# Altium schematic sheet USB-TO-UART-BRIDGE.SchDoc
size A3; ApprovedBy: SI; CheckedBy: SI; Author: SI; CompanyName: KundenName; DrawnBy: SI; Engineer: SI; Organization: Sven Ingelfinger IT-Trainer; Address1: Ruländerstraße 5; Address2: 74235; Address3: Erlenbach; SheetNumber: 4; SheetTotal: 7; OrganizationDescription: Altium Trainer & Consultant
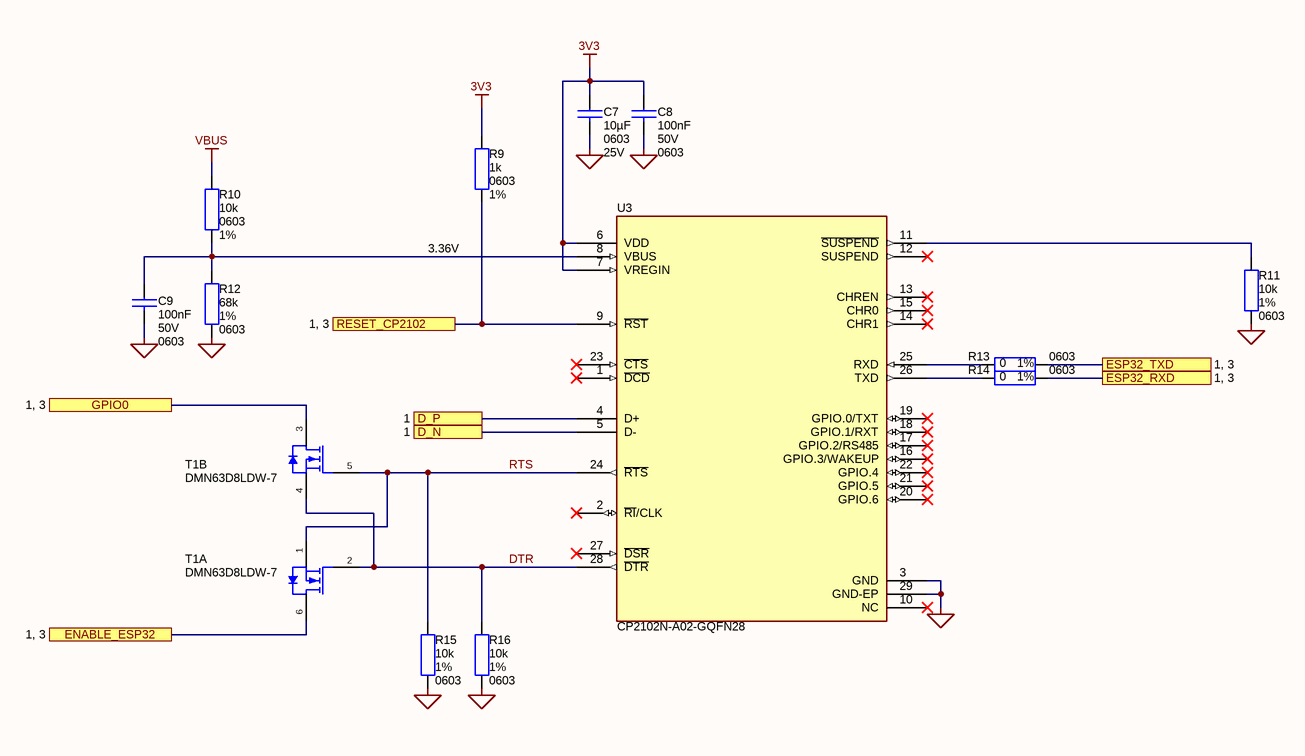
[diagram p0: USB-TO-UART-BRIDGE.SchDoc]

## Parts
C7  value 10µF  Case/Package: 0603  Voltage: 25V  [CAPC0603X37L]  (hidden comment: GRM188R61E106KA73D)
C8  value 100nF  Voltage: 50V  Case/Package: 0603  [CAPC0603X37L]  (hidden comment: C0603C104K5RACTU)
C9  value 100nF  Voltage: 50V  Case/Package: 0603  [CAPC0603X37L]  (hidden comment: C0603C104K5RACTU)
R9  value 1k  Case/Package: 0603  Tolerance: 1%  [RESC0603X21L]  (hidden comment: RC0603FR-071KL)
R10  value 10k  Case/Package: 0603  Tolerance: 1%  [RESC0603X21L]  (hidden comment: RC0603FR-0733KL)
R11  value 10k  Tolerance: 1%  Case/Package: 0603  [RESC0603X21L]  (hidden comment: RC0603FR-0710KL)
R12  value 68k  Tolerance: 1%  Case/Package: 0603  [RESC0603X21L]  (hidden comment: RC0603FR-0768KL)
R13  value 0  Case/Package: 0603  Tolerance: 1%  [RESC0603X21L]  (hidden comment: RC0603FR-070RL)
R14  value 0  Case/Package: 0603  Tolerance: 1%  [RESC0603X21L]  (hidden comment: RC0603FR-070RL)
R15  value 10k  Tolerance: 1%  Case/Package: 0603  [RESC0603X21L]  (hidden comment: RC0603FR-0710KL)
R16  value 10k  Tolerance: 1%  Case/Package: 0603  [RESC0603X21L]  (hidden comment: RC0603FR-0710KL)
T1  DMN63D8LDW-7  [SOT23-6P65_210X110L32X20]  (parts A,B of 2)
U3  CP2102N-A02-GQFN28  [CP2102N-A02-GQFN28-Footprint-1]

## Ports
D_N (see 1), D_P (see 1), ENABLE_ESP32 (see 1, 3), ESP32_RXD (see 1, 3), ESP32_TXD (see 1, 3), GPIO0 (see 1, 3), RESET_CP2102 (see 1, 3)

## Nets
3V3: C7.1 C8.1 R9.1 U3.6(VDD) U3.7(VREGIN)
GND: C7.2 C8.2 C9.2 R11.1 R12.2 R15.1 R16.1 U3.3(GND) U3.29(GND-EP)
VBUS: R10.1
D_N: U3.5(D-) ; port D_N
D_P: U3.4(D+) ; port D_P
DTR: R16.2 T1.2(G1) T1.4(S2) U3.28(~{DTR})
ENABLE_ESP32: T1.6(D1) ; port ENABLE_ESP32
ESP32_RXD: R14.1 ; port ESP32_RXD
ESP32_TXD: R13.1 ; port ESP32_TXD
GPIO0: T1.3(D2) ; port GPIO0
RESET_CP2102: R9.2 U3.9(~{RST}) ; port RESET_CP2102
RTS: R15.2 T1.1(S1) T1.5(G2) U3.24(~{RTS})
NetC9_1: C9.1 R10.2 R12.1 U3.8(VBUS)
NetR11_2: R11.2 U3.11(~{SUSPEND})
NetR13_2: R13.2 U3.25(RXD)
NetR14_2: R14.2 U3.26(TXD)

Not connected (* = marked no-connect by the designer): U3 1(~{DCD})* 2(~{RI}/CLK)* 10(NC)* 12(SUSPEND)* 13(CHREN)* 14(CHR1)* 15(CHR0)* 16(GPIO.3/WAKEUP)* 17(GPIO.2/RS485)* 18(GPIO.1/RXT)* 19(GPIO.0/TXT)* 20(GPIO.6)* 21(GPIO.5)* 22(GPIO.4)* 23(~{CTS})* 27(~{DSR})*

## Notes on the sheet
- 3.36V
- Project
- Schematic Sheet
- EDATRON Solutions GmbH
- Engineering | Training | Consulting
- www.edatron-solutions.com <http://www.edatron-solutions.com>
- Assembly Variant
- Drawn
- Date
- Checked
- Approved
- Project Number
- Customer
- Version/ Revisionindex
- Sheet
- /
- Contact Person
- Name:
- E-Mail:
- Phone:

## Library data of the parts
C7 = CMP-00180-01: CAPACITOR 10 µF 0603 X5R 25V 10%; Manufacturer 1: Murata; Comment Designer: can be substituted same values other manufacturer; Manufacturer 1 Part Number: GRM188R61E106KA73D; Operating Temperature (min): -55°C; Dielectric: X5R; Tolerance: 10%; Operating Temperature (max): 85°C
C8 C9 = CMP-00094-12: CAPACITOR 100 nF 0603 X7R 50V 10%; Manufacturer 1: Kemet; Comment Designer: can be substituted same values other manufacturer; Operating Temperature (max): 125°C; Manufacturer 1 Part Number: C0603C104K5RACTU; Dielectric: X7R; Operating Temperature (min): -55°C; Tolerance: 10%
R9 = CMP-009-00301-12: RESISTOR 1K 1% 0603 100mW; Manufacturer 1: Yageo; Comment Designer: can be substituted same values other manufacturers; Operating Temperature (min): -55°C; Manufacturer 1 Part Number: RC0603FR-071KL; Power: 100mW; Operating Temperature (max): 125°C
R10 = CMP-009-00319-12: RESISTOR 33K 1% 0603 100mW; Manufacturer 1: Yageo; Comment Designer: can be substituted same values other manufacturers; Operating Temperature (min): -55°C; Manufacturer 1 Part Number: RC0603FR-0733KL; Operating Temperature (max): 125°C; Power: 100mW
R11 R15 R16 = CMP-009-00313-12: RESISTOR 10K 1% 0603 100mW; Manufacturer 1: Yageo; Comment Designer: can be substituted same values other manufacturers; Power: 100mW; Operating Temperature (min): -55°C; Operating Temperature (max): 125°C; Manufacturer 1 Part Number: RC0603FR-0710KL
R12 = CMP-009-00323-12: RESISTOR 68K 1% 0603 100mW; Manufacturer 1: Yageo; Comment Designer: can be substituted same values other manufacturers; Manufacturer 1 Part Number: RC0603FR-0768KL; Operating Temperature (max): 125°C; Power: 100mW; Operating Temperature (min): -55°C
R13 R14 = CMP-009-00178-12: RESISTOR 0R 1% 0603 100mW; Manufacturer 1: Yageo; Comment Designer: can be substituted same values other manufacturers; Operating Temperature (min): -55°C; Power: 100mW; Manufacturer 1 Part Number: RC0603FR-070RL; Operating Temperature (max): 125°C
T1 = CMP-00188-02: Small Signal Field-Effect Transistor, 0.22A I(D), 30V, 2-Element, N-Channel, Silicon, Metal-oxide Semiconductor FET; Manufacturer 1: Diodes; Voltage-Drain to Source: 30; Channel Count: 2; Voltage-Gate to Source: 20; Power: 400; Voltage-Gate Threshold: 1.5; Type: N; Current: 220; RDS on: 13; Case/Package: SOT23-6P; Operating Temperature (min): -55°C; Manufacturer 1 Part Number: DMN63D8LDW-7; Value: DMN63D8LDW; Operating Temperature (max): 150°C
U3 = CMP-031-00000-03: USB-IC-Schnittstelle USBXpress - USB to UART Bridge QFN28; Manufacturer 1: Silicon Labs; Operating Temperature (max): 85°C; Storage Temperature (max): 150°C; Value: CP2102N-A02-GQFN28; Storage Temperature (min): -65°C; Manufacturer 1 Part Number: CP2102N-A02-GQFN28; Case/Package: QFN28; Operating Temperature (min): -40°C